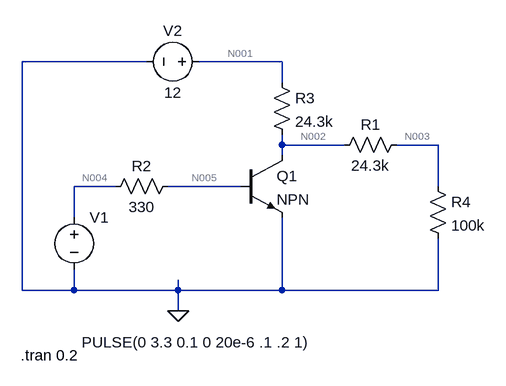
[diagram p0: schematic output_protection.asc]
output_protection.asc, the LTspice schematic file:
Version 4
SHEET 1 880 680
WIRE 112 -80 -80 -80
WIRE 320 -80 192 -80
WIRE 320 -48 320 -80
WIRE 320 48 320 32
WIRE 416 48 320 48
WIRE 560 48 496 48
WIRE 320 64 320 48
WIRE 64 112 0 112
WIRE 256 112 144 112
WIRE 560 112 560 48
WIRE 0 160 0 112
WIRE -80 272 -80 -80
WIRE 0 272 0 240
WIRE 0 272 -80 272
WIRE 160 272 160 256
WIRE 160 272 0 272
WIRE 320 272 320 160
WIRE 320 272 160 272
WIRE 560 272 560 192
WIRE 560 272 320 272
WIRE 160 304 160 272
FLAG 160 304 0
SYMBOL voltage 0 144 R0
WINDOW 3 12 208 Left 2
WINDOW 123 0 0 Left 2
WINDOW 39 0 0 Left 2
SYMATTR Value PULSE(0 3.3 0.1 0 20e-6 .1 .2 1)
SYMATTR InstName V1
SYMBOL npn 256 64 R0
SYMATTR InstName Q1
SYMBOL res 512 32 R90
WINDOW 0 0 56 VBottom 2
WINDOW 3 32 56 VTop 2
SYMATTR InstName R1
SYMATTR Value 24.3k
SYMBOL res 160 96 R90
WINDOW 0 0 56 VBottom 2
WINDOW 3 32 56 VTop 2
SYMATTR InstName R2
SYMATTR Value 330
SYMBOL voltage 208 -80 R90
WINDOW 0 -32 56 VBottom 2
WINDOW 3 32 56 VTop 2
WINDOW 123 0 0 Left 2
WINDOW 39 0 0 Left 2
SYMATTR InstName V2
SYMATTR Value 12
SYMBOL res 304 -64 R0
SYMATTR InstName R3
SYMATTR Value 24.3k
SYMBOL res 544 96 R0
SYMATTR InstName R4
SYMATTR Value 100k
TEXT -82 372 Left 2 !.tran 0.2

The netlist it stands for:
* output_protection.asc
V1 N004 0 PULSE(0 3.3 0.1 0 20e-6 .1 .2 1)
Q1 N002 N005 0 0 NPN
R1 N003 N002 24.3k
R2 N005 N004 330
V2 N001 0 12
R3 N001 N002 24.3k
R4 N003 0 100k
.model NPN NPN
.model PNP PNP
.lib standard.bjt
.tran 0.2
.backanno
.end

* Results of the author's LTspice run, read from the files saved beside the schematic
* Operating Point, zero values left out:
*   V(n002) = 10.04 V
*   V(n003) = 8.075 V
*   V(n001) = 12 V
*   Ic(Q1) = 10.04 pA
*   Ib(Q1) = -10.04 pA
*   I(R4) = 80.75 µA
*   I(R3) = 80.75 µA
*   I(R2) = 10.04 pA
*   I(R1) = -80.75 µA
*   I(V2) = -80.75 µA
*   I(V1) = 10.04 pA
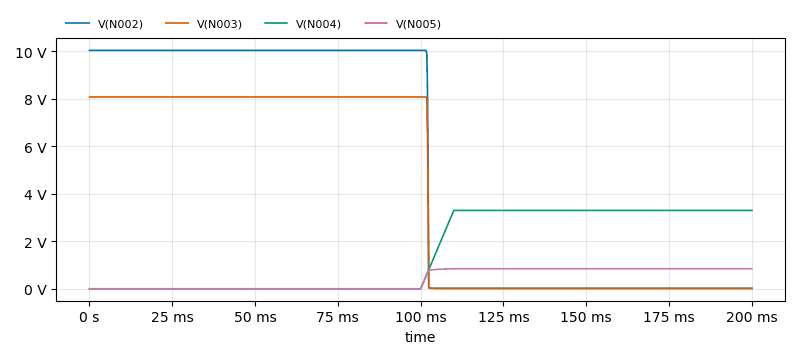
[diagram p1: Transient Analysis of output_protection.asc, plotted from the saved traces]
* Transient Analysis, 1 run:
*   V(N002): min 18.79 mV, max 10.04 V, average 5.139 V, rms 7.173 V, last 18.79 mV
*   V(N003): min 15.12 mV, max 8.075 V, average 4.134 V, rms 5.771 V, last 15.12 mV
*   V(N004): min 0 V, max 3.3 V, average 1.568 V, rms 2.255 V, last 3.3 V
*   V(N005): min 0 V, max 844.4 mV, average 415.9 mV, rms 590.8 mV, last 844.4 mV